# Altium schematic sheet Power_Stage.SchDoc
size A4
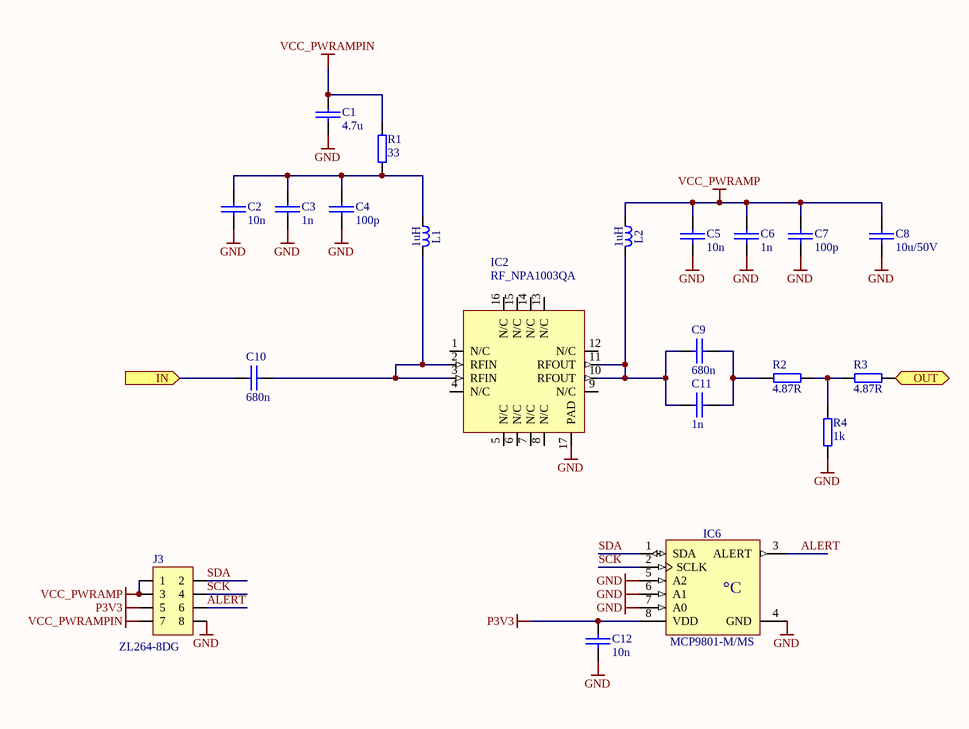
[diagram p0: Power_Stage.SchDoc]

## Parts
C1  4.7u  [0603C]
C2  10n  [0603C]
C3  1n  [0603C]
C4  100p  [0603C]
C5  10n  [0603C]
C6  1n  [0603C]
C7  100p  [0603C]
C8  10u/50V  [0805C]
C9  680n  [0603C]
C10  680n  [0603C]
C11  1n  [0603C]
C12  10n  [0603C]
IC2  RF_NPA1003QA  [QFN65P400X400X80_HS-17N]
IC6  MCP9801-M/MS  [SOP65P490X110-8N]
J3  ZL264-8DG  [ZL264-8DG]
L1  1uH  [INDP2520X18L]
L2  1uH  [INDP2520X18L]
R1  33  [0603R]
R2  4.87R  [0603R]
R3  4.87R  [0603R]
R4  1k  [0603R]

## Ports
IN (in), OUT (out)

## Nets
GND: C1.2 C2.2 C3.2 C4.2 C5.2 C6.2 C7.2 C8.2 C12.1 IC2.17(PAD) IC6.4(GND) IC6.5(A2) IC6.6(A1) IC6.7(A0) J3.8 R4.1
P3V3: C12.2 IC6.8(VDD) J3.5
VCC_PWRAMP: C5.1 C6.1 C7.1 C8.1 J3.1 J3.3 L2.1
VCC_PWRAMPIN: C1.1 J3.7 R1.2
ALERT: IC6.3(ALERT) J3.6
IN: C10.1 ; port IN
OUT: R3.2 ; port OUT
SCK: IC6.2(SCLK) J3.4
SDA: IC6.1(SDA) J3.2
NetC2_1: C2.1 C3.1 C4.1 L1.1 R1.1
NetC9_1: C9.1 C11.1 IC2.10(RFOUT) IC2.11(RFOUT) L2.2
NetC9_2: C9.2 C11.2 R2.1
NetC10_2: C10.2 IC2.2(RFIN) IC2.3(RFIN) L1.2
NetR2_2: R2.2 R3.1 R4.2

Not connected (* = marked no-connect by the designer): IC2 1(N/C) 4(N/C) 5(N/C) 6(N/C) 7(N/C) 8(N/C) 9(N/C) 12(N/C) 13(N/C) 14(N/C) 15(N/C) 16(N/C)

## Notes on the sheet
- (in symbol MCP9801-M/MS) °C

## Library data of the parts
C1 = CAP_SMD_0603: Capacitor SMD; Part: GRM21BR71C475KE51L; Supplier 1: Digi-Key; Supplier Part Number 1: 490-1524-2-ND
C2 C5 = CAP_SMD_0603: Capacitor SMD; Part: GRM1885C1H103JA01D; Supplier 1: Digi-Key; Supplier Part Number 1: 490-1524-2-ND
C3 C6 C11 = CAP_SMD_0603: Capacitor SMD; Part: GRM1885C1H102JA01D; Supplier 1: Digi-Key; Supplier Part Number 1: 490-1524-2-ND
C4 C7 = CAP_SMD_0603: Capacitor SMD; Part: C1608NP01H101J080AA; Supplier 1: Digi-Key; Supplier Part Number 1: 490-1524-2-ND
C8 = CAP_SMD_0805: Capacitor SMD; Part: GRM32ER71H106KA12L; Supplier 1: Farnell; Supplier Part Number 1: 1833812
C9 C10 = CAP_SMD_0603: Capacitor SMD; Part: GRM1555C1H681GA01; Supplier 1: Digi-Key; Supplier Part Number 1: 490-1524-2-ND
C12 = CAP_SMD_0603: Capacitor SMD; Supplier 1: Digi-Key; Supplier Part Number 1: 490-1524-2-ND
IC6 = MCP9801-M/MS: 2-Wire High-Accuracy Temperature Sensor; Manufacturer: MICROCHIP TECHNOLOGIY; PressFit: No; Bonding: No; Part Number: MCP9801-M/MS; Component Kind: Standard; Component Type: Standard; Device: MCP9801-M/MS; PackageDescription: SOP, 0.65mm pitch; 8 pin, 3.00mm W X 3.00mm L X 1.10mm H body, IPC Medium Density; Part Description: 2-Wire High-Accuracy Temperature Sensor; Manufacturer Part Number: MCP9801-M/MS; Pin Count: 8; Case: MSOP8; Mounted: Yes; Socket: No; SMD: Yes; Sense: No; ComponentHeight: 1.1mm; HelpURL: \\cern.ch\dfs\Applications\Altium\Datasheets\MCP9801-M-MS.pdf; Author: CERN DEM JLC; CreateDate: 18.11.2009; LatestRevisionDate: 18.11.2009
J3 = CON_2X4 2.54 SMT FEM: 2.54mm pitch connector
L1 = L_1008_100u: Part: LQW2UAS1R0J00L; Author: GK
L2 = L_1008_100u: 100uH, 60mA, 21R; Part: 1008LS-102XJLB; Author: GK
R1 = RES_0603: SMD Resistor; Part: CR0603-FX-33R0ELF; Supplier 1: Newark; Supplier Part Number 1: 39K0073
R2 R3 = RES_0603: SMD Resistor; Part: CPF0603B4R87E1; Supplier 1: Newark; Supplier Part Number 1: 39K0073
R4 = RES_0603: SMD Resistor; Part: RP73PF1J1K0BTDF; Supplier 1: Newark; Supplier Part Number 1: 39K0073